# Altium schematic sheet BoardB-FPGA.SchDoc
size A; SheetNumber: 3; SheetTotal: 9
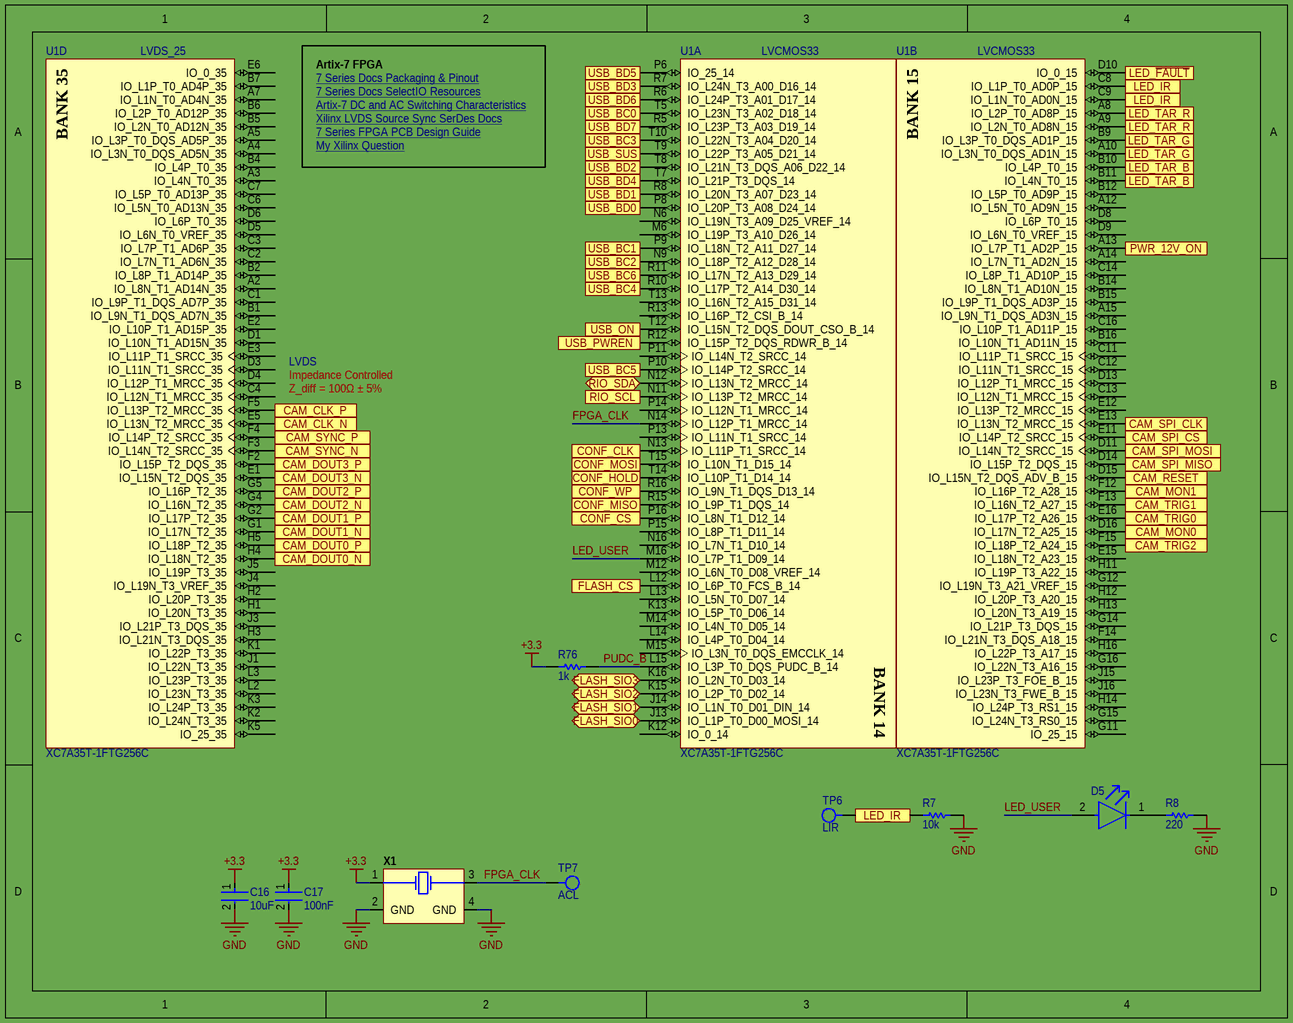
[diagram p0: BoardB-FPGA.SchDoc]

## Parts
C16  10uF  [FP-GRM188-0_1-e0_2_0_55-IPC_A]
C17  100nF  [FP-CGA3E-0_3-0_1-IPC_A]
D5  SML-D12U1WT86  [FP-SML-D12-MFG]  (value not drawn)
R7  10k  [RESC1609X55X30LL15T15]
R8  220  [RESC1005X40X25LL05T05]
R76  1k  [RESC0603X26X15ML03T05]
TP6  LIR  [TestPoint1mm]
TP7  ACL  [TestPoint1mm]
U1  XC7A35T-1FTG256C  [FTG256]  (parts A,B,D of 8)
X1  ASDMB-100.000MHZ-XY-T  [ASTMHTA-100.000MHZ-AJ-E-T]  (value not drawn)

## Ports
CAM_CLK_N (in), CAM_CLK_P (in), CAM_DOUT0_N (in), CAM_DOUT0_P (in), CAM_DOUT1_N (in), CAM_DOUT1_P (in), CAM_DOUT2_N (in), CAM_DOUT2_P (in), CAM_DOUT3_N (in), CAM_DOUT3_P (in), CAM_MON0 (in), CAM_MON1 (in), CAM_RESET (out), CAM_SPI_CLK (out), CAM_SPI_CS (out), CAM_SPI_MISO (in), CAM_SPI_MOSI (out), CAM_SYNC_N (in), CAM_SYNC_P (in), CAM_TRIG0 (out), CAM_TRIG1 (out), CAM_TRIG2 (out), CONF_CLK (out), CONF_CS (out), CONF_HOLD (out), CONF_MISO (in), CONF_MOSI (out), CONF_WP (out), FLASH_CS (out), FLASH_SIO0 (bidir), FLASH_SIO1 (bidir), FLASH_SIO2 (bidir), FLASH_SIO3 (bidir), LED_IR (out), LED_TAR_B (out), LED_TAR_G (out), LED_TAR_R (out), LED_~{FAULT} (in), PWR_12V_ON (in), RIO_SCL (in), RIO_SDA (bidir), USB_BC0, USB_BC1, USB_BC2, USB_BC3, USB_BC4, USB_BC5, USB_BC6, USB_BD0, USB_BD1, USB_BD2, USB_BD3, USB_BD4, USB_BD5, USB_BD6, USB_BD7, USB_ON (out), USB_PWREN (in), USB_SUS (in)

## Nets
+3.3: C16.1 C17.1 R76.2 X1.1
GND: C16.2 C17.2 R7.2 R8.2 X1.2(GND) X1.4(GND)
CAM_CLK_N: U1.E5(IO_L13N_T2_MRCC_35) ; port CAM_CLK_N
CAM_CLK_P: U1.F5(IO_L13P_T2_MRCC_35) ; port CAM_CLK_P
CAM_DOUT0_N: U1.H4(IO_L18N_T2_35) ; port CAM_DOUT0_N
CAM_DOUT0_P: U1.H5(IO_L18P_T2_35) ; port CAM_DOUT0_P
CAM_DOUT1_N: U1.G1(IO_L17N_T2_35) ; port CAM_DOUT1_N
CAM_DOUT1_P: U1.G2(IO_L17P_T2_35) ; port CAM_DOUT1_P
CAM_DOUT2_N: U1.G4(IO_L16N_T2_35) ; port CAM_DOUT2_N
CAM_DOUT2_P: U1.G5(IO_L16P_T2_35) ; port CAM_DOUT2_P
CAM_DOUT3_N: U1.E1(IO_L15N_T2_DQS_35) ; port CAM_DOUT3_N
CAM_DOUT3_P: U1.F2(IO_L15P_T2_DQS_35) ; port CAM_DOUT3_P
CAM_MON0: U1.D16(IO_L17N_T2_A25_15) ; port CAM_MON0
CAM_MON1: U1.F12(IO_L16P_T2_A28_15) ; port CAM_MON1
CAM_RESET: U1.D15(IO_L15N_T2_DQS_ADV_B_15) ; port CAM_RESET
CAM_SPI_CLK: U1.E13(IO_L13N_T2_MRCC_15) ; port CAM_SPI_CLK
CAM_SPI_CS: U1.E11(IO_L14P_T2_SRCC_15) ; port CAM_SPI_CS
CAM_SPI_MISO: U1.D14(IO_L15P_T2_DQS_15) ; port CAM_SPI_MISO
CAM_SPI_MOSI: U1.D11(IO_L14N_T2_SRCC_15) ; port CAM_SPI_MOSI
CAM_SYNC_N: U1.F3(IO_L14N_T2_SRCC_35) ; port CAM_SYNC_N
CAM_SYNC_P: U1.F4(IO_L14P_T2_SRCC_35) ; port CAM_SYNC_P
CAM_TRIG0: U1.E16(IO_L17P_T2_A26_15) ; port CAM_TRIG0
CAM_TRIG1: U1.F13(IO_L16N_T2_A27_15) ; port CAM_TRIG1
CAM_TRIG2: U1.F15(IO_L18P_T2_A24_15) ; port CAM_TRIG2
CONF_CLK: U1.N13(IO_L11P_T1_SRCC_14) ; port CONF_CLK
CONF_CS: U1.P16(IO_L8N_T1_D12_14) ; port CONF_CS
CONF_HOLD: U1.T14(IO_L10P_T1_D14_14) ; port CONF_HOLD
CONF_MISO: U1.R15(IO_L9P_T1_DQS_14) ; port CONF_MISO
CONF_MOSI: U1.T15(IO_L10N_T1_D15_14) ; port CONF_MOSI
CONF_WP: U1.R16(IO_L9N_T1_DQS_D13_14) ; port CONF_WP
FLASH_CS: U1.L12(IO_L6P_T0_FCS_B_14) ; port FLASH_CS
FLASH_SIO0: U1.J13(IO_L1P_T0_D00_MOSI_14) ; port FLASH_SIO0
FLASH_SIO1: U1.J14(IO_L1N_T0_D01_DIN_14) ; port FLASH_SIO1
FLASH_SIO2: U1.K15(IO_L2P_T0_D02_14) ; port FLASH_SIO2
FLASH_SIO3: U1.K16(IO_L2N_T0_D03_14) ; port FLASH_SIO3
FPGA_CLK: TP7.1 U1.N14(IO_L12P_T1_MRCC_14) X1.3
LED_~{FAULT}: U1.D10(IO_0_15) ; port LED_~{FAULT}
LED_IR: R7.1 TP6.1 U1.C8(IO_L1P_T0_AD0P_15) U1.C9(IO_L1N_T0_AD0N_15) ; port LED_IR
LED_TAR_B: U1.B10(IO_L4P_T0_15) U1.B11(IO_L4N_T0_15) ; port LED_TAR_B
LED_TAR_G: U1.A10(IO_L3N_T0_DQS_AD1N_15) U1.B9(IO_L3P_T0_DQS_AD1P_15) ; port LED_TAR_G
LED_TAR_R: U1.A8(IO_L2P_T0_AD8P_15) U1.A9(IO_L2N_T0_AD8N_15) ; port LED_TAR_R
LED_USER: D5.2(A) U1.M16(IO_L7P_T1_D09_14)
PUDC_B: R76.1 U1.L15(IO_L3P_T0_DQS_PUDC_B_14)
PWR_12V_ON: U1.A13(IO_L7P_T1_AD2P_15) ; port PWR_12V_ON
RIO_SCL: U1.N11(IO_L13P_T2_MRCC_14) ; port RIO_SCL
RIO_SDA: U1.N12(IO_L13N_T2_MRCC_14) ; port RIO_SDA
USB_BC0: U1.T5(IO_L23N_T3_A02_D18_14) ; port USB_BC0
USB_BC1: U1.P9(IO_L18N_T2_A11_D27_14) ; port USB_BC1
USB_BC2: U1.N9(IO_L18P_T2_A12_D28_14) ; port USB_BC2
USB_BC3: U1.T10(IO_L22N_T3_A04_D20_14) ; port USB_BC3
USB_BC4: U1.R10(IO_L17P_T2_A14_D30_14) ; port USB_BC4
USB_BC5: U1.P10(IO_L14P_T2_SRCC_14) ; port USB_BC5
USB_BC6: U1.R11(IO_L17N_T2_A13_D29_14) ; port USB_BC6
USB_BD0: U1.P8(IO_L20P_T3_A08_D24_14) ; port USB_BD0
USB_BD1: U1.R8(IO_L20N_T3_A07_D23_14) ; port USB_BD1
USB_BD2: U1.T8(IO_L21N_T3_DQS_A06_D22_14) ; port USB_BD2
USB_BD3: U1.R7(IO_L24N_T3_A00_D16_14) ; port USB_BD3
USB_BD4: U1.T7(IO_L21P_T3_DQS_14) ; port USB_BD4
USB_BD5: U1.P6(IO_25_14) ; port USB_BD5
USB_BD6: U1.R6(IO_L24P_T3_A01_D17_14) ; port USB_BD6
USB_BD7: U1.R5(IO_L23P_T3_A03_D19_14) ; port USB_BD7
USB_ON: U1.T12(IO_L15N_T2_DQS_DOUT_CSO_B_14) ; port USB_ON
USB_PWREN: U1.R12(IO_L15P_T2_DQS_RDWR_B_14) ; port USB_PWREN
USB_SUS: U1.T9(IO_L22P_T3_A05_D21_14) ; port USB_SUS
NetD5_1: D5.1(C) R8.1

Not connected (* = marked no-connect by the designer): U1 A2(IO_L8N_T1_AD14N_35) A3(IO_L4N_T0_35) A4(IO_L3N_T0_DQS_AD5N_35) A5(IO_L3P_T0_DQS_AD5P_35) A7(IO_L1N_T0_AD4N_35) A12(IO_L5N_T0_AD9N_15) A14(IO_L7N_T1_AD2N_15) A15(IO_L9N_T1_DQS_AD3N_15) B1(IO_L9N_T1_DQS_AD7N_35) B2(IO_L8P_T1_AD14P_35) B4(IO_L4P_T0_35) B5(IO_L2N_T0_AD12N_35) B6(IO_L2P_T0_AD12P_35) B7(IO_L1P_T0_AD4P_35) B12(IO_L5P_T0_AD9P_15) B14(IO_L8N_T1_AD10N_15) B15(IO_L9P_T1_DQS_AD3P_15) B16(IO_L10N_T1_AD11N_15) C1(IO_L9P_T1_DQS_AD7P_35) C2(IO_L7N_T1_AD6N_35) C3(IO_L7P_T1_AD6P_35) C4(IO_L12N_T1_MRCC_35) C6(IO_L5N_T0_AD13N_35) C7(IO_L5P_T0_AD13P_35) C11(IO_L11P_T1_SRCC_15) C12(IO_L11N_T1_SRCC_15) C13(IO_L12N_T1_MRCC_15) C14(IO_L8P_T1_AD10P_15) C16(IO_L10P_T1_AD11P_15) D1(IO_L10N_T1_AD15N_35) D3(IO_L11N_T1_SRCC_35) D4(IO_L12P_T1_MRCC_35) D5(IO_L6N_T0_VREF_35) D6(IO_L6P_T0_35) D8(IO_L6P_T0_15) D9(IO_L6N_T0_VREF_15) D13(IO_L12P_T1_MRCC_15) E2(IO_L10P_T1_AD15P_35) E3(IO_L11P_T1_SRCC_35) E6(IO_0_35) E12(IO_L13P_T2_MRCC_15) E15(IO_L18N_T2_A23_15) F14(IO_L21N_T3_DQS_A18_15) G11(IO_25_15) G12(IO_L19N_T3_A21_VREF_15) G14(IO_L21P_T3_DQS_15) G15(IO_L24N_T3_RS0_15) G16(IO_L22N_T3_A16_15) H1(IO_L20N_T3_35) H2(IO_L20P_T3_35) H3(IO_L21N_T3_DQS_35) H11(IO_L19P_T3_A22_15) H12(IO_L20P_T3_A20_15) H13(IO_L20N_T3_A19_15) H14(IO_L24P_T3_RS1_15) H16(IO_L22P_T3_A17_15) J1(IO_L22N_T3_35) J3(IO_L21P_T3_DQS_35) J4(IO_L19N_T3_VREF_35) J5(IO_L19P_T3_35) J15(IO_L23P_T3_FOE_B_15) J16(IO_L23N_T3_FWE_B_15) K1(IO_L22P_T3_35) K2(IO_L24N_T3_35) K3(IO_L24P_T3_35) K5(IO_25_35) K12(IO_0_14) K13(IO_L5P_T0_D06_14) L2(IO_L23N_T3_35) L3(IO_L23P_T3_35) L13(IO_L5N_T0_D07_14) L14(IO_L4P_T0_D04_14) M6(IO_L19P_T3_A10_D26_14) M12(IO_L6N_T0_D08_VREF_14) M14(IO_L4N_T0_D05_14) M15(IO_L3N_T0_DQS_EMCCLK_14) N6(IO_L19N_T3_A09_D25_VREF_14) N16(IO_L7N_T1_D10_14) P11(IO_L14N_T2_SRCC_14) P13(IO_L11N_T1_SRCC_14) P14(IO_L12N_T1_MRCC_14) P15(IO_L8P_T1_D11_14) R13(IO_L16P_T2_CSI_B_14) T13(IO_L16N_T2_A15_D31_14)

## Notes on the sheet
- (near U1) LVDS_25
- Artix-7 FPGA
- 7 Series Docs Packaging & Pinout <https://www.xilinx.com/support/documentation/user_guides/ug475_7Series_Pkg_Pinout.pdf>
- 7 Series Docs SelectIO Resources <https://www.xilinx.com/support/documentation/user_guides/ug471_7Series_SelectIO.pdf>
- LVCMOS33
- My Xilinx Question <https://forums.xilinx.com/t5/Video-and-Audio/Artix-7-LVDS-25-Speeds/td-p/1290996>
- Artix-7 DC and AC Switching Characteristics <https://www.xilinx.com/support/documentation/data_sheets/ds181_Artix_7_Data_Sheet.pdf>
- Xilinx LVDS Source Sync SerDes Docs <https://www.xilinx.com/content/dam/xilinx/support/documentation/application_notes/xapp585-lvds-source-synch-serdes-clock-multiplication.pdf>
- 7 Series FPGA PCB Design Guide <https://www.xilinx.com/support/documentation/user_guides/ug483_7Series_PCB.pdf>
- LVDS
- Impedance Controlled
- Z_diff = 100Ω ± 5%
- (in symbol CMP-0383-00028-1, part A) BANK 14
- (in symbol CMP-0383-00028-1, part B) BANK 15
- (in symbol CMP-0383-00028-1, part D) BANK 35

## Library data of the parts
C16 = CMP-2006-02792-2: Chip Multilayer Ceramic Capacitors for General Purpose, 0603, 10uF, X5R, 15%, 20%, 6.3V; Packaging: Tape and Reel; Voltage Rating (DC): 6.3V; Width: 0.031inch; Termination: SMD/SMT; Dielectric: X5R; Package Quantity: 4000; Voltage Rating: 6.3V; Capacitance: 10uF; Case/Package: 0603; Min Operating Temperature: -55°C; Voltage: 6.3V; Length: 1.6mm; Thickness: 0.035inch; Lead Free: Lead Free; Depth: 0.8mm; Case Code (Imperial): 0603; Max Operating Temperature: 85°C; Material: Ceramic; Height: 0.8mm; Tolerance: 20%; Mount: Surface Mount; REACH SVHC: No SVHC; Radiation Hardening: No; Case Code (Metric): 1608
C17 = CMP-2000-07546-2: Cap Ceramic 100nF 50V X7R 10% Pad SMD 0603 +125°C Automotive T/R; Weight: 7.1E-05oz; Composition: Ceramic; Max Operating Temperature: 125°C; Termination: SMD/SMT; Dielectric: X7R; Length: 1.6mm; Package Quantity: 1; REACH SVHC: No SVHC; Lead Free: Lead Free; Case Code (Metric): 1608; Min Operating Temperature: -55°C; Packaging: Tape and Reel; Tolerance: 10%; Voltage Rating: 50V; Case Code (Imperial): 0603; Capacitance: 100nF; Case/Package: 0603; Voltage Rating (DC): 50V; Depth: 0.8mm; Radiation Hardening: No; Ratings: AEC-Q200; Mount: Surface Mount; Voltage: 50V; Thickness: 0.035inch; Width: 0.8mm; Height: 0.8mm
D5 = CMP-08952-000009-1: LED RED DIFFUSED 1608 SMD; Manufacturer: Rohm; Led Orientation: Top View; Power Dissipation: 54mW; Forward Current: 20mA; Wavelength: 620nm; Reverse Voltage: 5V; Luminous Intensity: 63mcd; Forward Voltage: 2.2V; Mouser Description: SML-D12 Series Red 0603 Diffused 63 mcd 2.2 V Surface Mount LED; Temperature: -40°C to +85°C; Device Class L2: LEDs; Lead Free: Yes; Automotive: No; Octopart: https://octopart.com/sml-d12u1wt86-rohm-70850259; RoHS: TRUE; Colour: Red; Digikey Description: LED RED DIFFUSED 1608 SMD; Package: SML-D12; Device Class L1: Optoelectronics; Category: Diode; Temperature Range High: +85°C; Height: 0.65mm; ComponentLink2Description: Datasheet; Temperature Range Low: -40°C; ComponentLink2URL: https://www.rohm.com/datasheet/SML-D12U1W/sml-d12x1-e; Manufacturer Part Number: SML-D12U1WT86; Device Class L3: unset
R7 = CMP-1012-00623-3: Chip Resistor, 10 KOhm, +/- 1%, 0.1 W, -55 to 155 degC, 0603 (1608 Metric), RoHS, Tape and Reel; Manufacturer: Panasonic; Voltage Rating: 75V; Case\/Package: 0603; Power Rating: 100mW; Resistance: 10KOhm; Temperature Coefficient: 100ppm\/degreesC; Number of Pins: 2; Package Reference: 603; Depth: 0.8mm; Mount: SurfaceMount; Package Description: 2-Pin Surface Mount Device, Body 1.6 x 0.85 mm; Datasheet Version: 02/2017; Length: 1.6mm; Lead Free: LeadFree; Height: 0.45mm; Number of Terminations: 2; Max Power Dissipation: 100mW; Min Operating Temperature: -55degC; Datasheet URL: https://industrial.panasonic.com/cdbs/www-data/pdf/RDA0000/AOA0000C304.pdf; Termination: SMD/SMT; Case Code (Metric): 1608; Case Code (Imperial): 0603; Tolerance: 1%; Max Operating Temperature: 155degC; RoHSCompliant: true; Voltage Rating (DC): 75V; Radiation Hardening: No; Packaging: TapeandReel; Composition: ThickFilm; Mounting Technology: SurfaceMount; Manufacturer URL: http://www.panasonic.com/; Width: 0.031inch; REACH SVHC: NoSVHC; Contact Plating: Tin; Military Standard: Not; Package Quantity: 1
R8 = CMP-2002-00487-3: Chip Resistor, 220 Ohm, +/- 5%, 100 mW, -55 to 155 degC, 0402 (1005 Metric), RoHS, Tape and Reel; Manufacturer: Basic Passives; PartNumber: ERJ-2GEJ221X; Voltage Rating: 50 V; Case\/Package: 0402; Power Rating: 100 mW; Resistance: 220 Ohm; Mounting Technology: Surface Mount; Width: 0.5 mm; Package Quantity: 10000; REACH SVHC: Unknown; Height: 0.35 mm; PackageReference: 0402; PackageDescription: 2-Pin Surface Mount Device, Body 1 x 0.5 mm; Length: 1 mm; Max Operating Temperature: 155 degC; Tolerance: 5%; ComponentLink1Description: Manufacturer URL; Pins: 2; ComponentLink1URL: http://www.panasonic.com/; Min Operating Temperature: -55 degC; Case Code (Imperial): 0402; Mount: Surface Mount; Case Code (Metric): 1005; ComponentLink2URL: http://industrial.panasonic.com/cdbs/www-data/pdf/RDA0000/AOA0000C84.pdf; Packaging: Tape and Reel; ComponentLink2Description: Datasheet; DatasheetVersion: 04/2015; Radiation Hardening: No; RoHSCompliant: true
R76 = CMP-1010-00416-2: Manufacturer: Panasonic; Part Number: ERJ1GNF1001C
TP6 TP7 = TestPoint1mm: Test Point 1mm Diameter
U1 = CMP-0383-00028-1: Artix-7 FPGA, 170 User I/Os, 0 GTP, 256-Ball BGA, Speed Grade 1, Commercial Grade, Pb-Free; Manufacturer: Xilinx; Speed Grades: 1; Total Block RAM: 1800 Kb; CMTs: 5; GTP: 0; Available User I/O: 170; Logic Cells: 33280; ComponentLink2Description: Datasheet; ComponentLink2URL: http://www.xilinx.com/support/documentation/data_sheets/ds180_7Series_Overview.pdf; ComponentLink1Description: Manufacturer URL; Operating Temperature Range: Commercial; PackageVersion: Rev. 1.11; ComponentLink4URL: http://www.xilinx.com/support/documentation/user_guides/ug475_7Series_Pkg_Pinout.pdf; ComponentLink4Description: Package Specification; PackageDescription: 256-Ball Wire-Bond Fine-Pitch Thin BGA, Body 17 x 17 mm, Pitch 1 mm; Mounting Technology: Surface Mount; ComponentLink1URL: http://www.xilinx.com/; Maximum Distributed RAM: 400 Kb; PackageReference: FTG-256; DatasheetVersion: Rev. 1.15; ComponentLink3Description: Pinout; PartNumber: XC7A35T-1FTG256C; ComponentLink3URL: http://www.xilinx.com/support/documentation/user_guides/ug475_7Series_Pkg_Pinout.pdf
X1 = ASTMHTA-100.000MHZ-AJ-E-T: MEMS OSC XO 100.0000MHZ LVCMOS; Manufacturer: Abracon; Frequency: 100MHz; Load Capacitance: 15pF; Operating Supply Voltage: 3.6V; Frequency Stability: 10ppm; Max Supply Current: 16mA; RoHS: Yes; Stock 1: 2824; Pricing 1: 1=3.08000, 10=2.93800, 50=2.79080, 100=2.49700, 500=2.35008 (USD); Mount: Surface Mount; Case/Package: SMD/SMT; Number of Pins: 4; Min Operating Temperature: -40°C; Max Operating Temperature: 105°C; Packaging: Tape and Reel; Termination: SMD/SMT; Series: Pure Silicon™ ASDMB; Length: 0.098inch; Width: 0.079inch; Height: 0.035inch; Radiation Hardening: No; RoHS Compliant: Yes; Lead Free: Lead Free; ComponentLink1URL: https://datasheet.ciiva.com/1389/1750124-1389392.pdf?src-supplier=Newark; ComponentLink1Description: https://datasheet.ciiva.com/1389/1750124-1389392.pdf?src-supplier=Newark; ComponentLink2URL: https://datasheet.ciiva.com/866/asdmb-866812.pdf?src-supplier=Digi-Key; ComponentLink2Description: https://datasheet.ciiva.com/866/asdmb-866812.pdf?src-supplier=Digi-Key; ComponentLink3URL: https://datasheet.ciiva.com/866/asdmb-866813.pdf?src-supplier=Digi-Key; ComponentLink3Description: https://datasheet.ciiva.com/866/asdmb-866813.pdf?src-supplier=Digi-Key; ComponentLink4URL: https://datasheet.ciiva.com/866/asdmb-866814.pdf?src-supplier=Digi-Key; ComponentLink4Description: https://datasheet.ciiva.com/866/asdmb-866814.pdf?src-supplier=Digi-Key; ComponentLink5URL: https://datasheet.ciiva.com/3177/asdmb-3177639.pdf?src-supplier=Avnet; ComponentLink5Description: https://datasheet.ciiva.com/3177/asdmb-3177639.pdf?src-supplier=Avnet; Manufacturer Part Number: ASTMHTA-100.000MHZ-AJ-E-T; Category: Oscillators; Supplier 1: Digi-Key; Supplier Part Number 1: 535-15297-1-ND